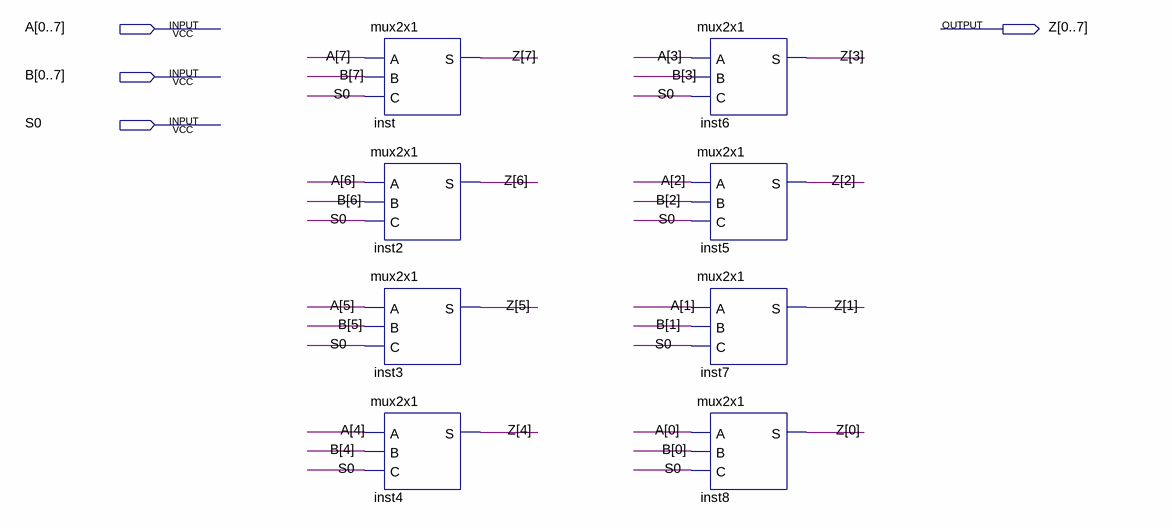
[diagram p0: schematic sheet]
// Quartus schematic mux.bdf as structural Verilog: 8 symbols, 4 pins
module mux (
  input  [0:7] A,
  input  [0:7] B,
  input  S0,
  output [0:7] Z
);

  mux2x1 inst (.A(A[7]), .B(B[7]), .C(S0), .S(Z[7]));
  mux2x1 inst2 (.A(A[6]), .B(B[6]), .C(S0), .S(Z[6]));
  mux2x1 inst3 (.A(A[5]), .B(B[5]), .C(S0), .S(Z[5]));
  mux2x1 inst4 (.A(A[4]), .B(B[4]), .C(S0), .S(Z[4]));
  mux2x1 inst6 (.A(A[3]), .B(B[3]), .C(S0), .S(Z[3]));
  mux2x1 inst5 (.A(A[2]), .B(B[2]), .C(S0), .S(Z[2]));
  mux2x1 inst7 (.A(A[1]), .B(B[1]), .C(S0), .S(Z[1]));
  mux2x1 inst8 (.A(A[0]), .B(B[0]), .C(S0), .S(Z[0]));
endmodule
